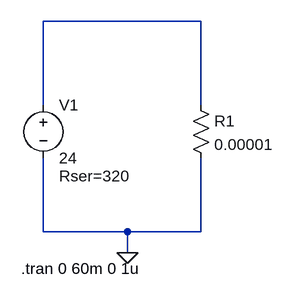
[diagram p0: schematic scheme.asc]
scheme.asc, the LTspice schematic file:
Version 4
SHEET 1 880 680
WIRE 416 0 176 0
WIRE 176 128 176 0
WIRE 416 128 416 0
WIRE 176 320 176 208
WIRE 304 320 176 320
WIRE 416 320 416 208
WIRE 416 320 304 320
WIRE 304 352 304 320
FLAG 304 352 0
SYMBOL voltage 176 112 R0
WINDOW 123 0 0 Left 0
WINDOW 39 24 124 Left 2
SYMATTR InstName V1
SYMATTR Value 24
SYMATTR SpiceLine Rser=320
SYMBOL res 400 112 R0
SYMATTR InstName R1
SYMATTR Value 0.00001
TEXT 142 376 Left 2 !.tran 0 60m 0 1u

The netlist it stands for:
* scheme.asc
V1 N001 0 24 Rser=320
R1 N001 0 0.00001
.tran 0 60m 0 1u
.backanno
.end